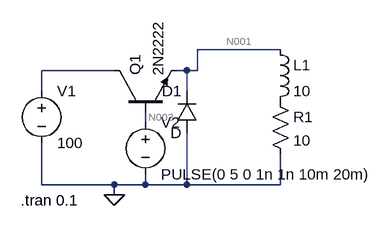
[diagram p0: schematic StepDown-Chopper-RL-FD.asc]
StepDown-Chopper-RL-FD.asc, the LTspice schematic file:
Version 4
SHEET 1 880 680
WIRE 368 32 240 32
WIRE 112 64 0 64
WIRE 224 64 208 64
WIRE 240 64 240 32
WIRE 240 64 224 64
WIRE 0 96 0 64
WIRE 224 96 224 64
WIRE 160 144 160 128
WIRE 0 240 0 176
WIRE 112 240 0 240
WIRE 160 240 160 224
WIRE 160 240 112 240
WIRE 224 240 224 160
WIRE 224 240 160 240
WIRE 368 240 368 192
WIRE 368 240 224 240
WIRE 112 256 112 240
FLAG 112 256 0
SYMBOL voltage 0 80 R0
WINDOW 123 0 0 Left 0
WINDOW 39 0 0 Left 0
SYMATTR InstName V1
SYMATTR Value 100
SYMBOL res 352 96 R0
SYMATTR InstName R1
SYMATTR Value 10
SYMBOL npn 112 128 R270
SYMATTR InstName Q1
SYMATTR Value 2N2222
SYMBOL voltage 160 128 R0
WINDOW 123 0 0 Left 0
WINDOW 39 0 0 Left 0
SYMATTR InstName V2
SYMATTR Value PULSE(0 5 0 1n 1n 10m 20m)
SYMBOL diode 240 160 R180
WINDOW 0 24 64 Left 2
WINDOW 3 24 0 Left 2
SYMATTR InstName D1
SYMBOL ind 352 16 R0
SYMATTR InstName L1
SYMATTR Value 10
TEXT -32 264 Left 2 !.tran 0.1

The netlist it stands for:
* StepDown-Chopper-RL-FD.asc
V1 N002 0 100
R1 P001 0 10
Q1 N002 N003 N001 0 2N2222
V2 N003 0 PULSE(0 5 0 1n 1n 10m 20m)
D1 0 N001 D
L1 N001 P001 10
.model D D
.lib standard.dio
.model NPN NPN
.model PNP PNP
.lib standard.bjt
.tran 0.1
.backanno
.end

* Results of the author's LTspice run, read from the files saved beside the schematic
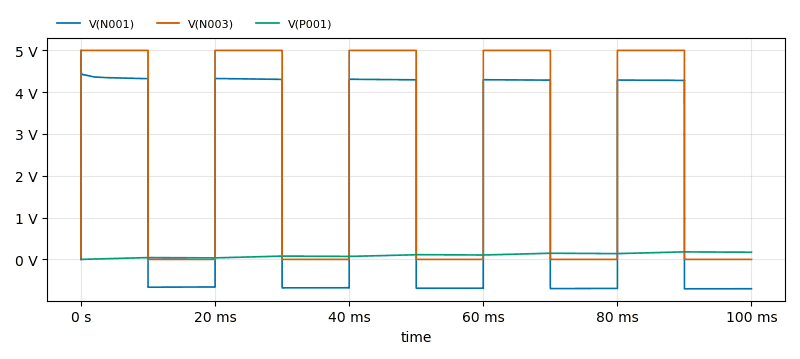
[diagram p1: Transient Analysis of StepDown-Chopper-RL-FD.asc, plotted from the saved traces]
* Transient Analysis, 1 run:
*   V(N001): min -703.4 mV, max 5.001 V, average 1.812 V, rms 3.087 V, last -702 mV
*   V(N003): min 0 V, max 5 V, average 2.5 V, rms 3.536 V, last 0 V
*   V(P001): min 0 V, max 179.9 mV, average 99.98 mV, rms 112.3 mV, last 171.2 mV